# Altium schematic sheet SDCARD_FLASH.SchDoc
size B
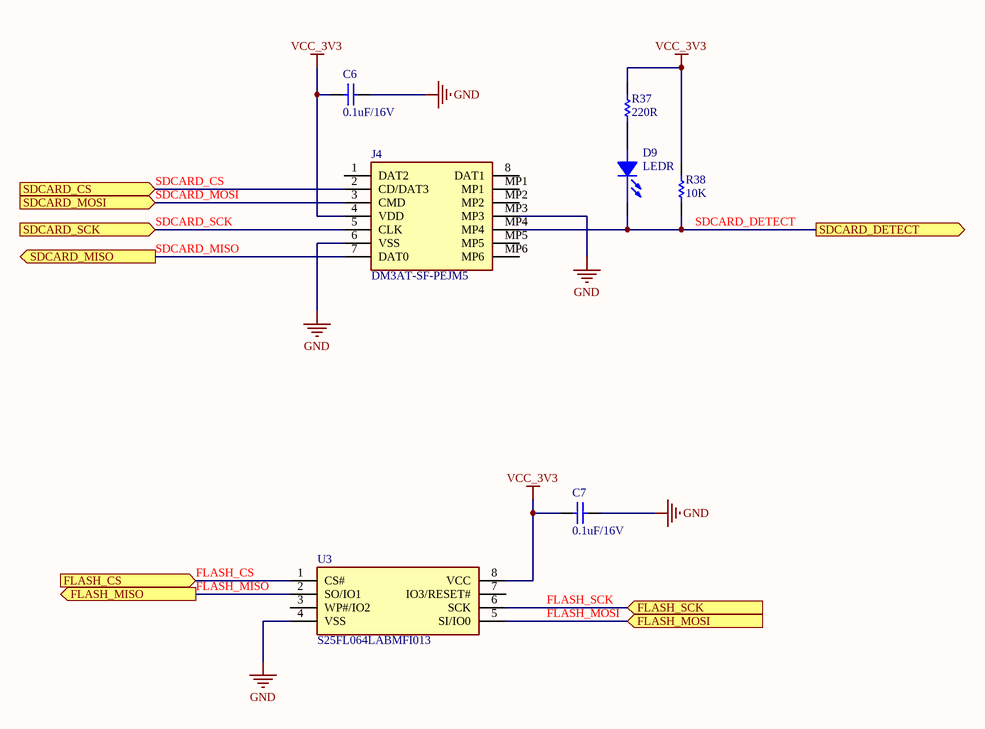
[diagram p0: SDCARD_FLASH.SchDoc]

## Parts
C6  0.1uF/16V  [0603C]
C7  0.1uF/16V  [0603C]
D9  LEDR  [LED_0603]
J4  DM3AT-SF-PEJM5  [DM3ATSFPEJM5]
R37  220R  [0603R]
R38  10K  [0603R]
U3  S25FL064LABMFI013  [S25FL064LABMFI013]

## Ports
FLASH_CS (in), FLASH_MISO (out), FLASH_MOSI (in), FLASH_SCK (in), SDCARD_CS (in), SDCARD_DETECT (out), SDCARD_MISO (out), SDCARD_MOSI (in), SDCARD_SCK (in)

## Nets
GND: C6.1 C7.1 J4.6(VSS) J4.MP3 U3.4(VSS)
VCC_3V3: C6.2 C7.2 J4.4(VDD) R37.2 R38.1 U3.8(VCC)
FLASH_CS: U3.1(CS#) ; port FLASH_CS
FLASH_MISO: U3.2(SO/IO1) ; port FLASH_MISO
FLASH_MOSI: U3.5(SI/IO0) ; port FLASH_MOSI
FLASH_SCK: U3.6(SCK) ; port FLASH_SCK
SDCARD_CS: J4.2(CD/DAT3) ; port SDCARD_CS
SDCARD_DETECT: D9.2(CATHODE) J4.MP4 R38.2 ; port SDCARD_DETECT
SDCARD_MISO: J4.7(DAT0) ; port SDCARD_MISO
SDCARD_MOSI: J4.3(CMD) ; port SDCARD_MOSI
SDCARD_SCK: J4.5(CLK) ; port SDCARD_SCK
NetD9_1: D9.1(ANODE) R37.1

Not connected (* = marked no-connect by the designer): J4 1(DAT2) 8(DAT1) MP1 MP2 MP5 MP6; U3 3(WP#/IO2) 7(IO3/RESET#)

## Library data of the parts
C6 C7 = Cap: Multilayer Ceramic Capacitors MLCC - SMD/SMT 0603 16VDC 0.1uF 10% X7R AEC-Q2000; Mfr: Taiyo Yuden; Mfr Part No: EMK107B7104KAHT; Value: 0.1uF/16V; Package: 0603; Price: 0.101; Stockiest: MOUSER; Stockiest Part No: 963-EMK107B7104KAHT
D9 = LED: Standard LEDs - SMD Red 631nm 14mcd 5mA; Mfr: Lite On; Mfr Part No: LTST-C193KRKT-5A; Package: 0603; Price: 0.28; Stockiest: MOUSER; Stockiest Part No: 859-LTSTC193KRKT5A; Value: RED
J4 = DM3AT-SF-PEJM5: Memory Card Connectors R/A SMT MICROSD CON PUSH-PUSH TOP BRDMNT; Mfr: Hirose Connector; Mfr Part No: DM3AT-SF-PEJM5; Price: 2.52; Stockiest: MOUSER; Stockiest Part No: 798-DM3AT-SF-PEJM5
R37 = Res1: Thick Film Resistors - SMD 1/10Watt 220ohms 5% Commercial Use; Mfr: Vishay / Dale; Mfr Part No: CRCW0603220RJNEAC; Package: 0603; Price: 0.101; Stockiest: MOUSER; Stockiest Part No: 71-CRCW0603220RJNEAC; Value: 220R
R38 = Res1: Thick Film Resistors - SMD 0603 10Kohms 1% Anti-Sulfur AEC-Q200; Mfr: ROHM Semiconductor; Mfr Part No: SFR03EZPF1002; Value: 10K; Package: 0603; Price: 0.101; Stockiest: MOUSER; Stockiest Part No: 755-SFR03EZPF1002
U3 = S25FL064LABMFI013: NOR Flash Nor; Mfr: Cypress Semiconductor; Value: 64Mbit; Mfr Part No: S25FL064LABMFI013; Price: 1.45; Stockiest: MOUSER; Stockiest Part No: 727-S25FL064LAMFI013